# EAGLE design rapidshark-display-shifter-mk-3.1 (EAGLE 6.5.0)
AUTHOR: sean@yak.net
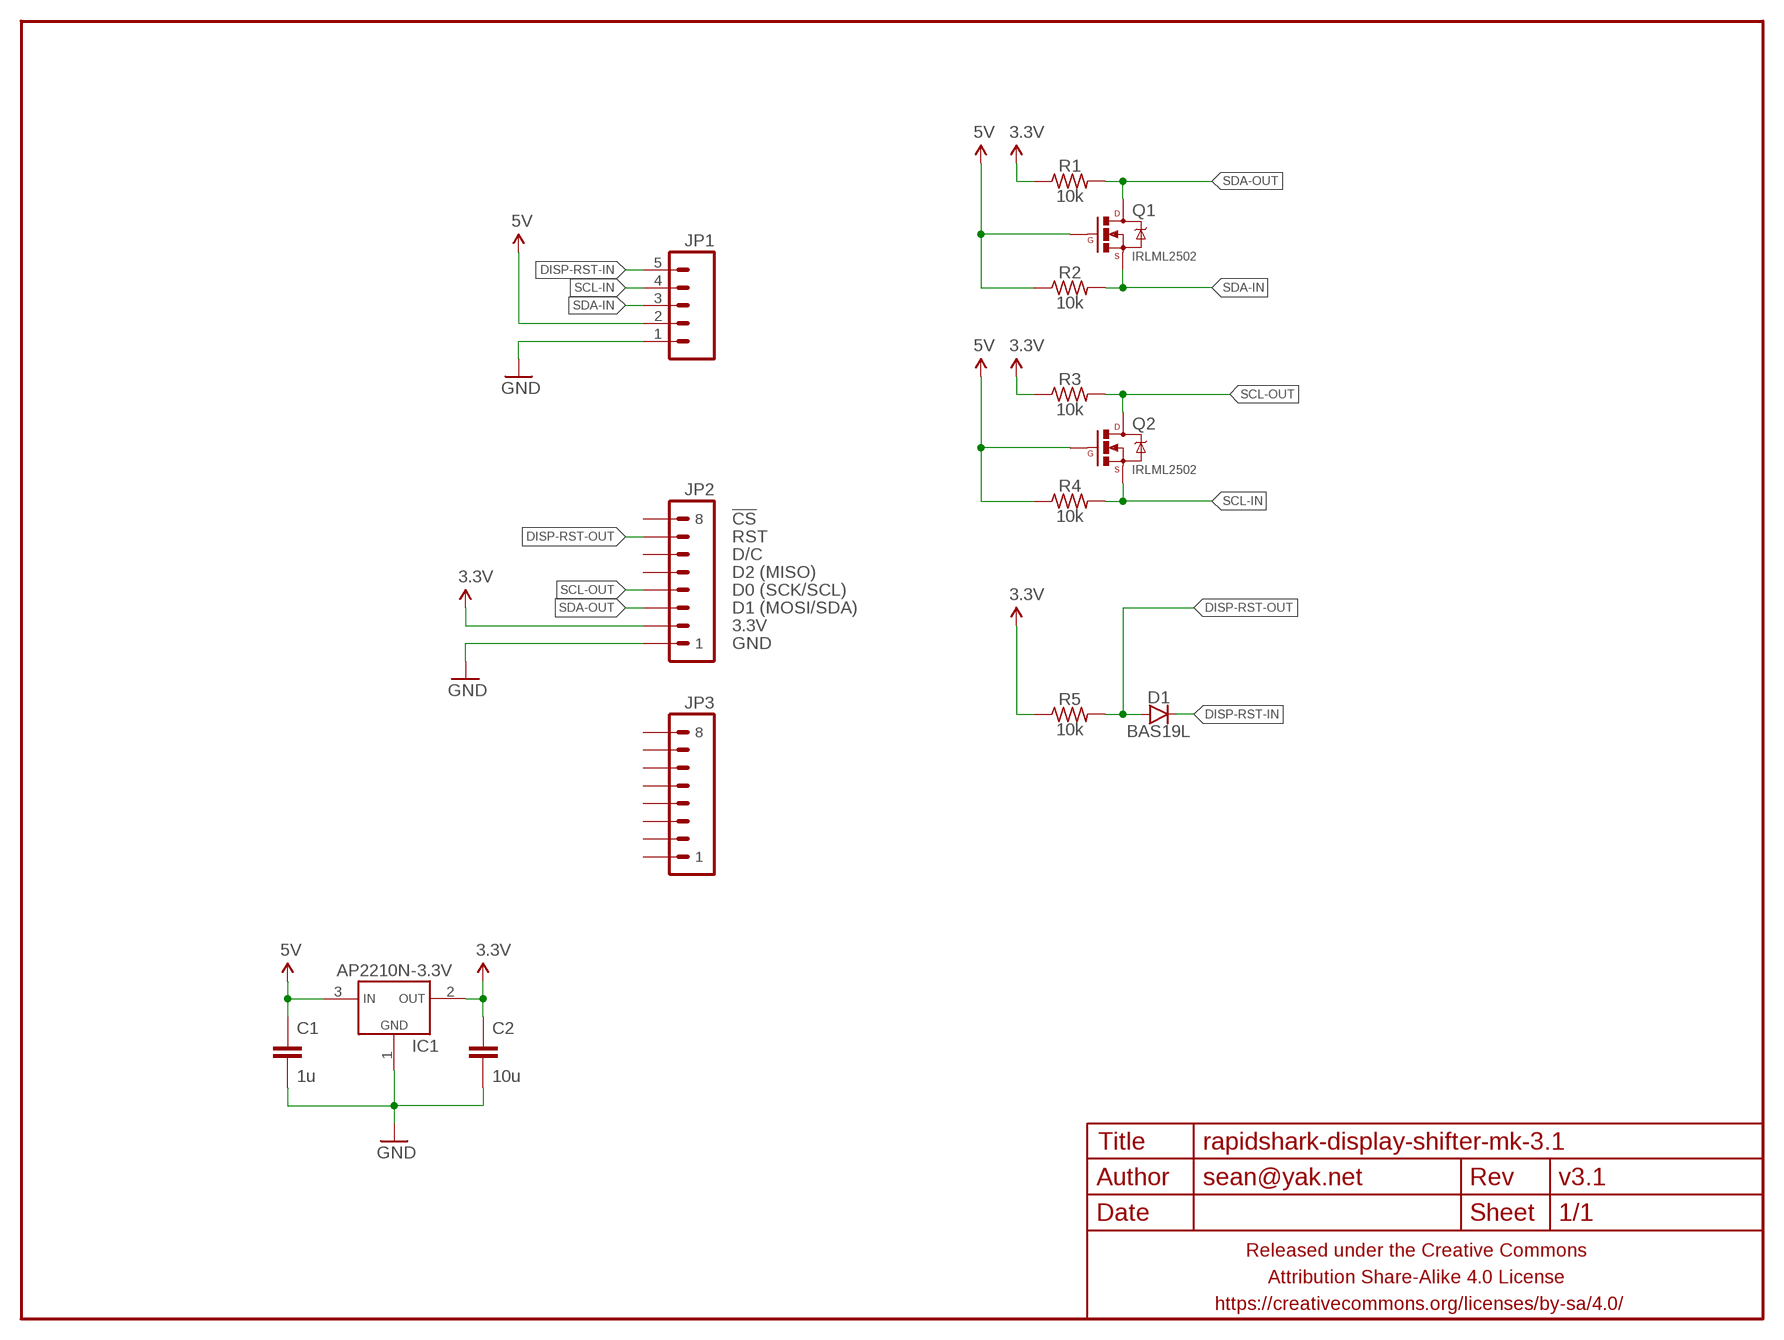
[diagram p0: schematic, sheet 1]

## Parts
C1  1u  CAPACITOR-CERAMICC0805  [C0805]
C2  10u  CAPACITOR-CERAMICC0805  [C0805]
D1  BAS19L  DIODESOT23  [SOT23]
FRAME1  FRAME-LETTERNO_PACKAGE  [DUMMY]
IC1  AP2210N-3.3V  VREG_1117SOT-23  [SOT23]
JP1  M05PTH-CENTERED  [1X05_PTH_CENTERED]
JP2  M081X08  [1X08]
JP3  M081X08  [1X08]
Q1  IRLML2502  MOSFET-NCHANNELIRLML2502  [SOT23]
Q2  IRLML2502  MOSFET-NCHANNELIRLML2502  [SOT23]
R1  10k  RESISTORR0603  [R0603]
R2  10k  RESISTORR0603  [R0603]
R3  10k  RESISTORR0603  [R0603]
R4  10k  RESISTORR0603  [R0603]
R5  10k  RESISTORR0603  [R0603]

## Nets
3.3V: C2.1 IC1.2(VOUT) JP2.2 R1.1 R3.1 R5.1
5V: C1.1 IC1.3(VIN) JP1.2 Q1.1(G) Q2.1(G) R2.1 R4.1
DISP-RST-IN: D1.3(C) JP1.5
DISP-RST-OUT: D1.1(A) JP2.7 R5.2
GND: C1.2 C2.2 IC1.1(GND) JP1.1 JP2.1
SCL-IN: JP1.4 Q2.2(S) R4.2
SCL-OUT: JP2.4 Q2.3(D) R3.2
SDA-IN: JP1.3 Q1.2(S) R2.2
SDA-OUT: JP2.3 Q1.3(D) R1.2
Unconnected: JP2.5 JP2.6 JP2.8 JP3.1 JP3.2 JP3.3 JP3.4 JP3.5 JP3.6 JP3.7 JP3.8

## Notes on the sheet
- !CS
- RST
- D/C
- D2 (MISO)
- D0 (SCK/SCL)
- D1 (MOSI/SDA)
- 3.3V
- GND

## Library data of the parts
C1 C2 = A_butts:CAPACITOR-CERAMIC: CAPACITOR, European symbol
D1 = A_butts:DIODE: Diode These are standard reverse protection diodes and small signal diodes. SMA package can handle up to about 1A. SOD-323 can handle about 200mA. What the SOD-323 package when ordering, there are some mfgs out there that are 5-pin packages.
FRAME1 = A_butts:FRAME-LETTER: Schematic Frame Standard 8.5x11 US Letter frame; DESIGNER: sean@yak.net; VERSION: v3.1
IC1 = A_butts:VREG_1117
JP1 = A_butts:M05: Header 5 Standard 5-pin 0.1" header. Use with straight break away headers (SKU : PRT-00116), right angle break away headers (PRT-00553), swiss pins (PRT-00743), machine pins (PRT-00117), and female headers (PRT-00115). Molex polarized connector foot print use with SKU : PRT-08230 with associated crimp pins and housings.
JP2 JP3 = A_butts:M08: Header 8 Standard 8-pin 0.1" header. Use with straight break away headers (SKU : PRT-00116), right angle break away headers (PRT-00553), swiss pins (PRT-00743), machine pins (PRT-00117), and female headers (PRT-00115).
Q1 Q2 = A_butts:MOSFET-NCHANNEL: Common NMOSFET Parts MFG P/N Store ID Prod ID FDD8780 TRANS-09984 SI7820DN TRANS-11055 FDS6630A IC-08089 2N7002PW TRANS-11151 FQP30N06L COM-10213 TRANS-10060 BSS123LT1G TRANS-08345 BSS138 TRANS-00830 BS170 2N7000
R1-R5 = A_butts:RESISTOR: RESISTOR, American symbol

## Board
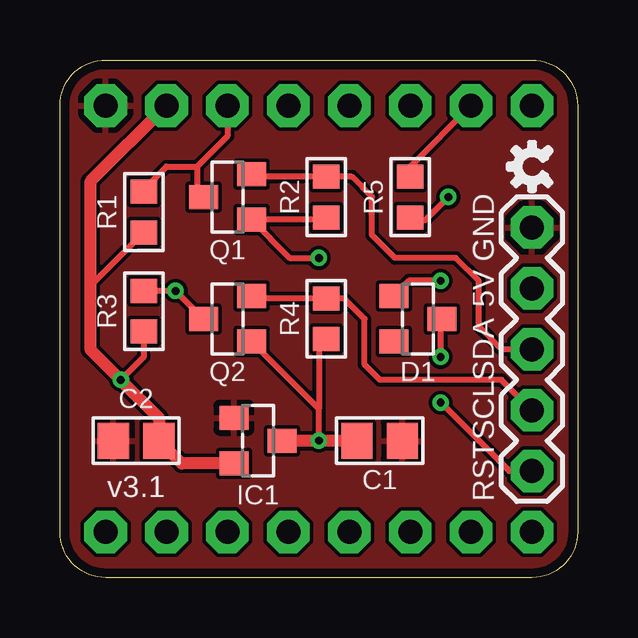
[diagram p1: board, top side]
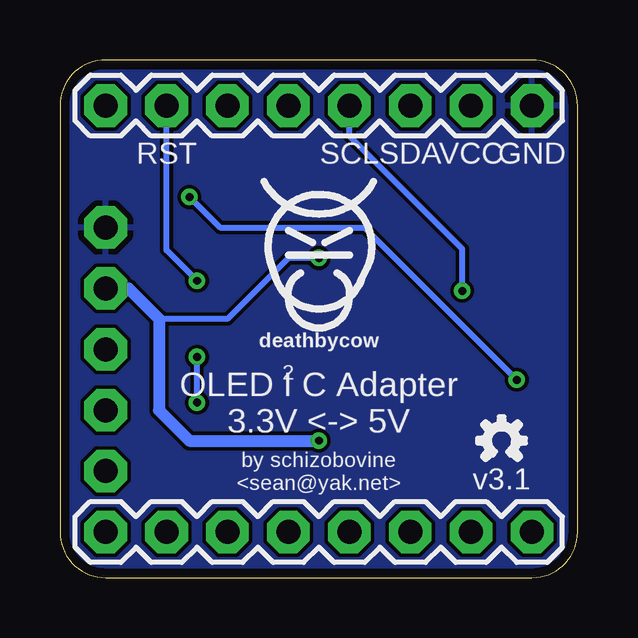
[diagram p2: board, bottom side, seen from below]

Size 21.59 x 21.59 mm. Coordinates in mm from the lower left corner, seen from the top.
Outline: 19.69,0 1.91,0 arc-90 0,1.91 0,19.69 arc-90 1.91,21.59 19.69,21.59 arc-90 21.59,19.69 21.59,1.91 arc-90 19.69,0
Copper layers (1*16): Top 0.0356mm / dielectric 1.5011mm / Bottom 0.0356mm
Design rules "LaenPCBOrder_2": minimum track width 6mil, minimum drill 13mil, track to track 6mil, track to pad 6mil, pad to pad 6mil, via to via 6mil, smd to smd 6mil, copper to edge 15mil, drill to drill 6mil, minimum pad ring 7mil, minimum via ring 7mil, stop-mask expansion 3mil, vias tented up to drill 20mil, thermal gap 10mil

### Footprints (pad centres in the part's own frame; a part is rotated, then mirrored left to right if it is on the bottom)
C0805 = smd 1.3 x 1.5: 1 -0.95,0; 2 0.95,0
SOT23 = smd 1 x 1.2: 1 -0.95,-1; 2 0.95,-1; 3 0,1
1X05_PTH_CENTERED = drill 1 pad 1.778 octagon: 1 -5.08,0; 2 -2.54,0; 3 0,0; 4 2.54,0; 5 5.08,0
1X08 = drill 1 pad 1.778 octagon: 1 0,0; 2 2.54,0; 3 5.08,0; 4 7.62,0; 5 10.16,0; 6 12.7,0; 7 15.24,0; 8 17.78,0
R0603 = smd 1 x 1.1: 1 -0.85,0; 2 0.85,0

### Placement (x,y rotation side)
C1  13.33,5.71 0 top
C2  3.17,5.71 180 top
D1  14.92,10.79 270 top
FRAME1  0.64,0.64 270 bottom
IC1  8.26,5.71 270 top
JP1  19.69,9.53 270 top
JP2  1.91,19.69 180 bottom
JP3  1.91,1.91 180 bottom
Q1  6.98,15.88 90 top
Q2  6.98,10.79 90 top
R1  3.49,15.24 90 top
R2  11.11,15.88 90 top
R3  3.49,11.11 90 top
R4  11.11,10.79 90 top
R5  14.61,15.88 90 top
U$1  [COW_SMALL]  10.79,13.97 0 bottom
U$2  [OSHWLOGO_TINY_SILKONLY]  19.69,17.15 90 top
U$3  [OSHWLOGO_TINY_SILKONLY]  3.17,5.71 0 bottom

### Tracks (layer width: path | path; a pad name or v marks a point on that pad's centre or on a via)
3.3V  (via drill 0.33)
  Top 0.254: R5.1 14.71,14.92 15.24,14.92 v16.19,15.88 | R1.1 1.27,12.17 1.27,12.06 | R3.1 3.49,9.21 v2.54,8.26
  Top 0.508: IC1.2 5.08,4.76 C2.1 4.12,6.67 v2.54,8.26 1.27,9.53 1.27,12.06 1.27,16.51 JP2.2
  Bottom 0.254: v16.19,15.88 14.92,14.61 8.89,14.61 v2.54,8.26
5V  (via drill 0.33)
  Top 0.254: v10.79,5.71 10.79,7.04 | 10.79,7.04 Q2.1 | R4.1 10.79,9.63 10.79,7.04 | v10.79,13.33 9.57,13.33 Q1.1 11.01,14.92 R2.1
  Top 0.508: IC1.3 v10.79,5.71 C1.1
  Bottom 0.254: v10.79,13.33 12.06,13.33 14.61,10.79 17.46,10.79
  Bottom 0.508: JP1.2 18.73,12.06 17.46,10.79 17.46,6.98 16.19,5.71 v10.79,5.71
DISP-RST-IN  (via drill 0.33)
  Top 0.254: JP1.5 18.73,4.45 v15.88,7.3 | v15.88,9.21 15.88,10.75 D1.3
  Bottom 0.254: v15.88,7.3 v15.88,9.21
DISP-RST-OUT  (via drill 0.33)
  Top 0.254: v15.88,12.38 14.56,12.38 D1.1 | R5.2 14.61,17.15 JP2.7
  Bottom 0.254: v15.88,12.38 17.15,13.65 JP2.7
GND
  pour Top (rank 6): 19.69,0 1.91,0 arc-90 0,1.91 0,19.69 arc-90 1.91,21.59 19.69,21.59 arc-90 21.59,19.69 21.59,1.91 arc-90
  pour Bottom (rank 6): 19.69,0 1.91,0 arc-90 0,1.91 0,19.69 arc-90 1.91,21.59 19.69,21.59 arc-90 21.59,19.69 21.59,1.91 arc-90
SCL-IN
  Top 0.254: JP1.4 18.42,8.26 13.33,8.26 12.7,8.89 12.7,10.79 11.85,11.64 R4.2 8.09,11.64 Q2.2
SCL-OUT  (via drill 0.33)
  Top 0.254: Q2.3 v4.82,11.96 R3.2
  Bottom 0.254: v4.82,11.96 4.82,13.71 9.53,18.42 JP2.4
SDA-IN
  Top 0.254: JP1.3 18.42,9.53 17.46,10.48 17.46,12.38 16.51,13.33 13.97,13.33 13.02,14.29 13.02,15.88 12.17,16.73 R2.2 8.09,16.73 Q1.2
SDA-OUT
  Top 0.254: JP2.3 6.98,18.42 5.71,17.15 | 5.71,17.15 5.71,16.14 Q1.3 | R1.2 3.49,16.19 4.45,17.15 5.71,17.15

### Text on the board
tPlace: GND | 5V | SDA | SCL | RST
bPlace: GND | VCC | SDA | SCL | RST | 2 | OLED I C Adapter / 3.3V <-> 5V | by schizobovine / <sean@yak.net>